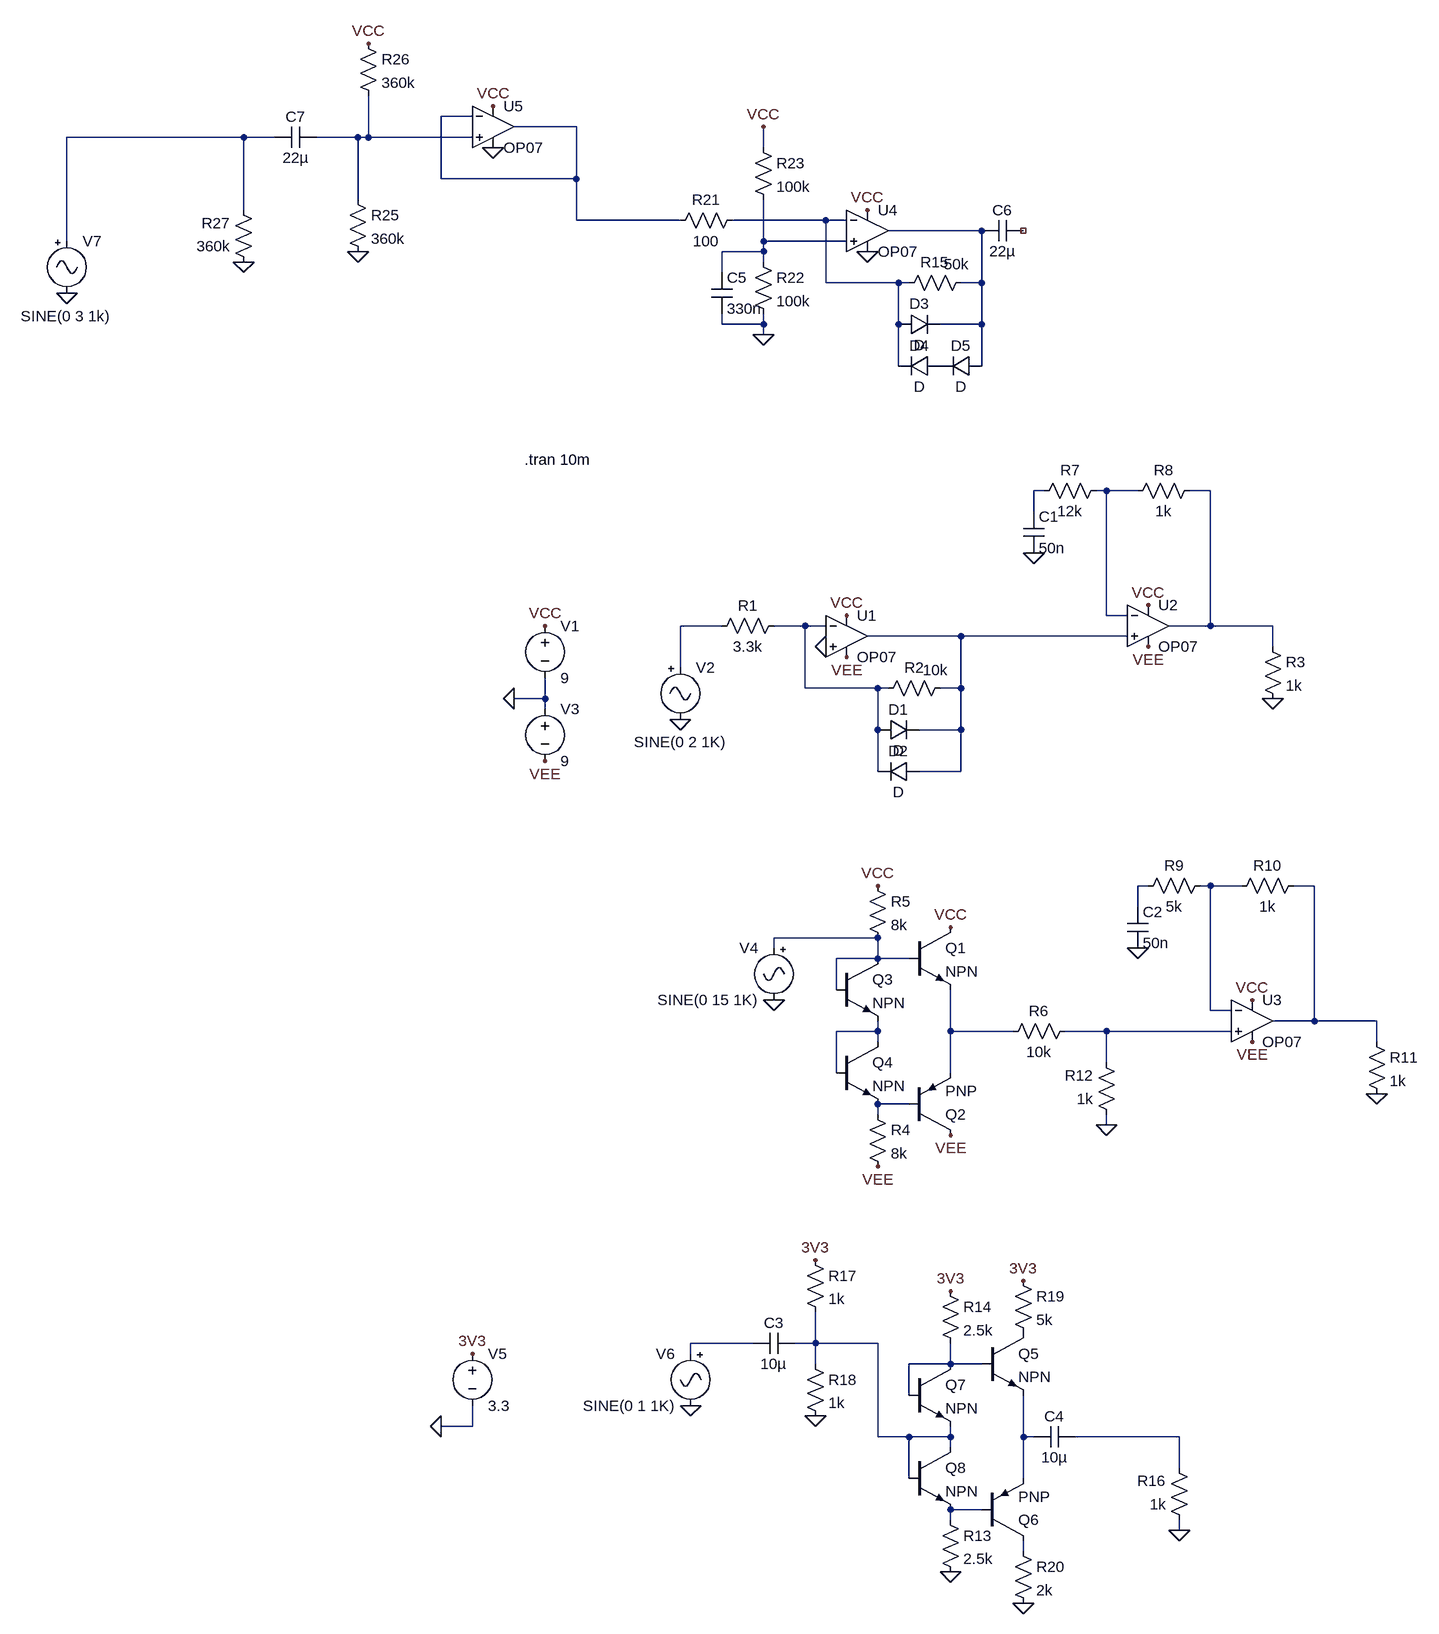
[diagram p0: schematic distortion.asc]
distortion.asc, the LTspice schematic file:
Version 4
SHEET 1 1284 1660
WIRE -352 -656 -400 -656
WIRE -192 -640 -288 -640
WIRE -704 -624 -976 -624
WIRE -656 -624 -704 -624
WIRE -528 -624 -592 -624
WIRE -512 -624 -512 -688
WIRE -512 -624 -528 -624
WIRE -352 -624 -512 -624
WIRE 96 -608 96 -640
WIRE -400 -560 -400 -656
WIRE -192 -560 -192 -640
WIRE -192 -560 -400 -560
WIRE -528 -528 -528 -624
WIRE -704 -512 -704 -624
WIRE -192 -496 -192 -560
WIRE -32 -496 -192 -496
WIRE 192 -496 48 -496
WIRE 224 -496 192 -496
WIRE 432 -480 288 -480
WIRE -976 -464 -976 -624
WIRE 96 -464 96 -528
WIRE 224 -464 96 -464
WIRE 96 -448 96 -464
WIRE 96 -448 32 -448
WIRE 96 -432 96 -448
WIRE 32 -416 32 -448
WIRE 192 -400 192 -496
WIRE 304 -400 192 -400
WIRE 320 -400 304 -400
WIRE 432 -400 432 -480
WIRE 432 -400 400 -400
WIRE 32 -336 32 -352
WIRE 96 -336 96 -352
WIRE 96 -336 32 -336
WIRE 304 -336 304 -400
WIRE 432 -336 432 -400
WIRE 432 -336 368 -336
WIRE 96 -320 96 -336
WIRE 304 -272 304 -336
WIRE 432 -272 432 -336
WIRE 528 -80 512 -80
WIRE 624 -80 608 -80
WIRE 672 -80 624 -80
WIRE 784 -80 752 -80
WIRE 512 -48 512 -80
WIRE 624 112 624 -80
WIRE 656 112 624 112
WIRE 32 128 -32 128
WIRE 160 128 112 128
WIRE 192 128 160 128
WIRE 784 128 784 -80
WIRE 784 128 720 128
WIRE 880 128 784 128
WIRE 400 144 256 144
WIRE 656 144 400 144
WIRE 880 160 880 128
WIRE -32 192 -32 128
WIRE 160 224 160 128
WIRE 272 224 160 224
WIRE 288 224 272 224
WIRE 400 224 400 144
WIRE 400 224 368 224
WIRE -240 240 -240 208
WIRE -240 240 -288 240
WIRE -240 256 -240 240
WIRE 272 288 272 224
WIRE 400 288 400 224
WIRE 400 288 336 288
WIRE 272 352 272 288
WIRE 400 352 400 288
WIRE 400 352 336 352
WIRE 688 528 672 528
WIRE 784 528 768 528
WIRE 832 528 784 528
WIRE 944 528 912 528
WIRE 672 560 672 528
WIRE 272 608 112 608
WIRE 112 624 112 608
WIRE 272 640 272 608
WIRE 272 640 208 640
WIRE 320 640 272 640
WIRE 208 688 208 640
WIRE 784 720 784 528
WIRE 816 720 784 720
WIRE 944 736 944 528
WIRE 944 736 880 736
WIRE 1040 736 944 736
WIRE 272 752 272 736
WIRE 272 752 208 752
WIRE 384 752 384 688
WIRE 480 752 384 752
WIRE 624 752 560 752
WIRE 816 752 624 752
WIRE 272 768 272 752
WIRE 1040 768 1040 736
WIRE 624 800 624 752
WIRE 208 816 208 752
WIRE 384 816 384 752
WIRE 320 864 272 864
WIRE 272 880 272 864
WIRE 624 896 624 880
WIRE 80 1232 -16 1232
WIRE 176 1232 176 1184
WIRE 176 1232 144 1232
WIRE 272 1232 176 1232
WIRE -16 1248 -16 1232
WIRE 176 1264 176 1232
WIRE 384 1264 384 1232
WIRE 384 1264 320 1264
WIRE 432 1264 384 1264
WIRE 320 1312 320 1264
WIRE -352 1360 -352 1328
WIRE -352 1360 -400 1360
WIRE 272 1376 272 1232
WIRE 320 1376 272 1376
WIRE 384 1376 384 1360
WIRE 384 1376 320 1376
WIRE 496 1376 496 1312
WIRE 512 1376 496 1376
WIRE 736 1376 576 1376
WIRE 384 1392 384 1376
WIRE 736 1424 736 1376
WIRE 320 1440 320 1376
WIRE 496 1440 496 1376
WIRE 432 1488 384 1488
WIRE 384 1504 384 1488
WIRE 736 1520 736 1504
WIRE 496 1552 496 1536
FLAG -240 128 VCC
FLAG -288 240 0
FLAG 224 112 VCC
FLAG -32 272 0
FLAG -240 336 VEE
FLAG 224 176 VEE
FLAG 192 160 0
FLAG 384 912 VEE
FLAG 272 960 VEE
FLAG 272 528 VCC
FLAG 112 704 0
FLAG 688 96 VCC
FLAG 688 160 VEE
FLAG 512 16 0
FLAG 880 240 0
FLAG 848 704 VCC
FLAG 848 768 VEE
FLAG 672 624 0
FLAG 1040 848 0
FLAG 624 896 0
FLAG -352 1248 3V3
FLAG -400 1360 0
FLAG 384 1584 0
FLAG -16 1328 0
FLAG 736 1520 0
FLAG 176 1344 0
FLAG 176 1104 3V3
FLAG 496 1632 0
FLAG 384 1152 3V3
FLAG 496 1136 3V3
FLAG 256 -512 VCC
FLAG -976 -384 0
FLAG 256 -448 0
FLAG 96 -320 0
FLAG 96 -640 VCC
FLAG 384 592 VCC
FLAG -704 -432 0
FLAG -512 -768 VCC
FLAG -528 -448 0
FLAG -320 -672 VCC
FLAG -320 -608 0
SYMBOL OpAmps/OP07 224 80 R0
SYMATTR InstName U1
SYMBOL res 384 208 R90
WINDOW 0 0 56 VBottom 2
WINDOW 3 -28 23 VTop 2
SYMATTR InstName R2
SYMATTR Value 10k
SYMBOL voltage -240 112 R0
SYMATTR InstName V1
SYMATTR Value 9
SYMBOL Misc/signal -32 176 R0
WINDOW 3 -71 131 Left 2
SYMATTR Value SINE(0 2 1K)
SYMATTR InstName V2
SYMBOL voltage -240 240 R0
SYMATTR InstName V3
SYMATTR Value 9
SYMBOL res 128 112 R90
WINDOW 0 0 56 VBottom 2
WINDOW 3 32 56 VTop 2
SYMATTR InstName R1
SYMATTR Value 3.3k
SYMBOL diode 272 304 R270
WINDOW 0 32 32 VTop 2
WINDOW 3 0 32 VBottom 2
SYMATTR InstName D1
SYMBOL diode 336 336 R90
WINDOW 0 0 32 VBottom 2
WINDOW 3 32 32 VTop 2
SYMATTR InstName D2
SYMBOL npn 320 592 R0
SYMATTR InstName Q1
SYMBOL pnp 320 912 M180
SYMATTR InstName Q2
SYMBOL npn 208 640 R0
SYMATTR InstName Q3
SYMBOL npn 208 768 R0
SYMATTR InstName Q4
SYMBOL res 256 864 R0
SYMATTR InstName R4
SYMATTR Value 8k
SYMBOL res 256 512 R0
SYMATTR InstName R5
SYMATTR Value 8k
SYMBOL Misc/signal 112 608 M0
SYMATTR InstName V4
SYMATTR Value SINE(0 15 1K)
SYMBOL OpAmps/OP07 688 64 R0
SYMATTR InstName U2
SYMBOL res 624 -96 R90
WINDOW 0 0 56 VBottom 2
WINDOW 3 32 56 VTop 2
SYMATTR InstName R7
SYMATTR Value 12k
SYMBOL res 768 -96 R90
WINDOW 0 0 56 VBottom 2
WINDOW 3 32 56 VTop 2
SYMATTR InstName R8
SYMATTR Value 1k
SYMBOL cap 496 -48 R0
SYMATTR InstName C1
SYMATTR Value 50n
SYMBOL res 864 144 R0
SYMATTR InstName R3
SYMATTR Value 1k
SYMBOL OpAmps/OP07 848 672 R0
SYMATTR InstName U3
SYMBOL res 784 512 R90
WINDOW 0 0 56 VBottom 2
WINDOW 3 32 56 VTop 2
SYMATTR InstName R9
SYMATTR Value 5k
SYMBOL res 928 512 R90
WINDOW 0 0 56 VBottom 2
WINDOW 3 32 56 VTop 2
SYMATTR InstName R10
SYMATTR Value 1k
SYMBOL cap 656 560 R0
SYMATTR InstName C2
SYMATTR Value 50n
SYMBOL res 1024 752 R0
SYMATTR InstName R11
SYMATTR Value 1k
SYMBOL res 576 736 R90
WINDOW 0 0 56 VBottom 2
WINDOW 3 32 56 VTop 2
SYMATTR InstName R6
SYMATTR Value 10k
SYMBOL res 640 896 R180
WINDOW 0 36 76 Left 2
WINDOW 3 36 40 Left 2
SYMATTR InstName R12
SYMATTR Value 1k
SYMBOL voltage -352 1232 R0
SYMATTR InstName V5
SYMATTR Value 3.3
SYMBOL npn 432 1216 R0
SYMATTR InstName Q5
SYMBOL pnp 432 1536 M180
SYMATTR InstName Q6
SYMBOL npn 320 1264 R0
SYMATTR InstName Q7
SYMBOL npn 320 1392 R0
SYMATTR InstName Q8
SYMBOL res 368 1488 R0
SYMATTR InstName R13
SYMATTR Value 2.5k
SYMBOL res 368 1136 R0
SYMATTR InstName R14
SYMATTR Value 2.5k
SYMBOL Misc/signal -16 1232 M0
SYMATTR InstName V6
SYMBOL res 752 1520 R180
WINDOW 0 36 76 Left 2
WINDOW 3 36 40 Left 2
SYMATTR InstName R16
SYMATTR Value 1k
SYMBOL res 160 1088 R0
SYMATTR InstName R17
SYMATTR Value 1k
SYMBOL res 160 1248 R0
SYMATTR InstName R18
SYMATTR Value 1k
SYMBOL cap 144 1216 R90
WINDOW 0 0 32 VBottom 2
WINDOW 3 32 32 VTop 2
SYMATTR InstName C3
SYMATTR Value 10µ
SYMBOL cap 576 1360 R90
WINDOW 0 0 32 VBottom 2
WINDOW 3 32 32 VTop 2
SYMATTR InstName C4
SYMATTR Value 10µ
SYMBOL res 480 1120 R0
SYMATTR InstName R19
SYMATTR Value 5k
SYMBOL res 480 1536 R0
SYMATTR InstName R20
SYMATTR Value 2k
SYMBOL OpAmps/OP07 256 -544 R0
SYMATTR InstName U4
SYMBOL res 416 -416 R90
WINDOW 0 0 56 VBottom 2
WINDOW 3 -28 23 VTop 2
SYMATTR InstName R15
SYMATTR Value 50k
SYMBOL Misc/signal -976 -480 R0
WINDOW 3 -71 131 Left 2
SYMATTR Value SINE(0 3 1k)
SYMATTR InstName V7
SYMBOL res 64 -512 R90
WINDOW 0 0 56 VBottom 2
WINDOW 3 32 56 VTop 2
SYMATTR InstName R21
SYMATTR Value 100
SYMBOL diode 304 -320 R270
WINDOW 0 32 32 VTop 2
WINDOW 3 0 32 VBottom 2
SYMATTR InstName D3
SYMBOL diode 368 -288 R90
WINDOW 0 0 32 VBottom 2
WINDOW 3 32 32 VTop 2
SYMATTR InstName D4
SYMBOL res 80 -448 R0
SYMATTR InstName R22
SYMATTR Value 100k
SYMBOL res 80 -624 R0
SYMATTR InstName R23
SYMATTR Value 100k
SYMBOL cap 16 -416 R0
SYMATTR InstName C5
SYMATTR Value 330n
SYMBOL res -688 -416 R180
WINDOW 0 36 76 Left 2
WINDOW 3 36 40 Left 2
SYMATTR InstName R27
SYMATTR Value 360k
SYMBOL cap -592 -640 R90
WINDOW 0 0 32 VBottom 2
WINDOW 3 32 32 VTop 2
SYMATTR InstName C7
SYMATTR Value 22µ
SYMBOL res -544 -544 R0
SYMATTR InstName R25
SYMATTR Value 360k
SYMBOL res -528 -784 R0
SYMATTR InstName R26
SYMATTR Value 360k
SYMBOL OpAmps/OP07 -320 -704 R0
SYMATTR InstName U5
SYMBOL diode 432 -288 R90
WINDOW 0 0 32 VBottom 2
WINDOW 3 32 32 VTop 2
SYMATTR InstName D5
SYMBOL cap 496 -496 R90
WINDOW 0 0 32 VBottom 2
WINDOW 3 32 32 VTop 2
SYMATTR InstName C6
SYMATTR Value 22µ
TEXT -272 -128 Left 2 !.tran 10m

The netlist it stands for:
* distortion.asc
XU1 0 N011 VCC VEE N012 LT1001  ; OP07, pins In+ In- V+ V- OUT
R2 N012 N011 10k
V1 VCC 0 9
V2 N010 0 SINE(0 2 1K)
V3 0 VEE 9
R1 N011 N010 3.3k
D1 N011 N012 D
D2 N012 N011 D
Q1 VCC N016 N018 0 NPN
Q2 VEE N020 N018 0 PNP
Q3 N016 N016 N017 0 NPN
Q4 N017 N017 N020 0 NPN
R4 N020 VEE 8k
R5 VCC N016 8k
V4 N016 0 SINE(0 15 1K)
XU2 N012 N008 VCC VEE N009 LT1001  ; OP07, pins In+ In- V+ V- OUT
R7 N008 N007 12k
R8 N009 N008 1k
C1 N007 0 50n
R3 N009 0 1k
XU3 N019 N014 VCC VEE N015 LT1001  ; OP07, pins In+ In- V+ V- OUT
R9 N014 N013 5k
R10 N015 N014 1k
C2 N013 0 50n
R11 N015 0 1k
R6 N019 N018 10k
R12 0 N019 1k
V5 3V3 0 3.3
Q5 P001 N023 N024 0 NPN
Q6 N027 N026 N024 0 PNP
Q7 N023 N023 N022 0 NPN
Q8 N022 N022 N026 0 NPN
R13 N026 0 2.5k
R14 3V3 N023 2.5k
V6 N021 0 SINE(0 1 1K)
R16 0 N025 1k
R17 3V3 N022 1k
R18 N022 0 1k
C3 N022 N021 10µ
C4 N025 N024 10µ
R19 3V3 P001 5k
R20 N027 0 2k
XU4 N006 N004 VCC 0 N005 LT1001  ; OP07, pins In+ In- V+ V- OUT
R15 N005 N004 50k
V7 N002 0 SINE(0 3 1k)
R21 N004 N001 100
D3 N004 N005 D
D4 P002 N004 D
R22 N006 0 100k
R23 VCC N006 100k
C5 N006 0 330n
R27 0 N002 360k
C7 N003 N002 22µ
R25 N003 0 360k
R26 VCC N003 360k
XU5 N003 N001 VCC 0 N001 LT1001  ; OP07, pins In+ In- V+ V- OUT
D5 N005 P002 D
C6 NC_01 N005 22µ
.model D D
.lib standard.dio
.model NPN NPN
.model PNP PNP
.lib standard.bjt
.tran 10m
.lib LTC.lib
.backanno
.end